# EAGLE design prject arkom robot running folower (EAGLE 9.6.2)
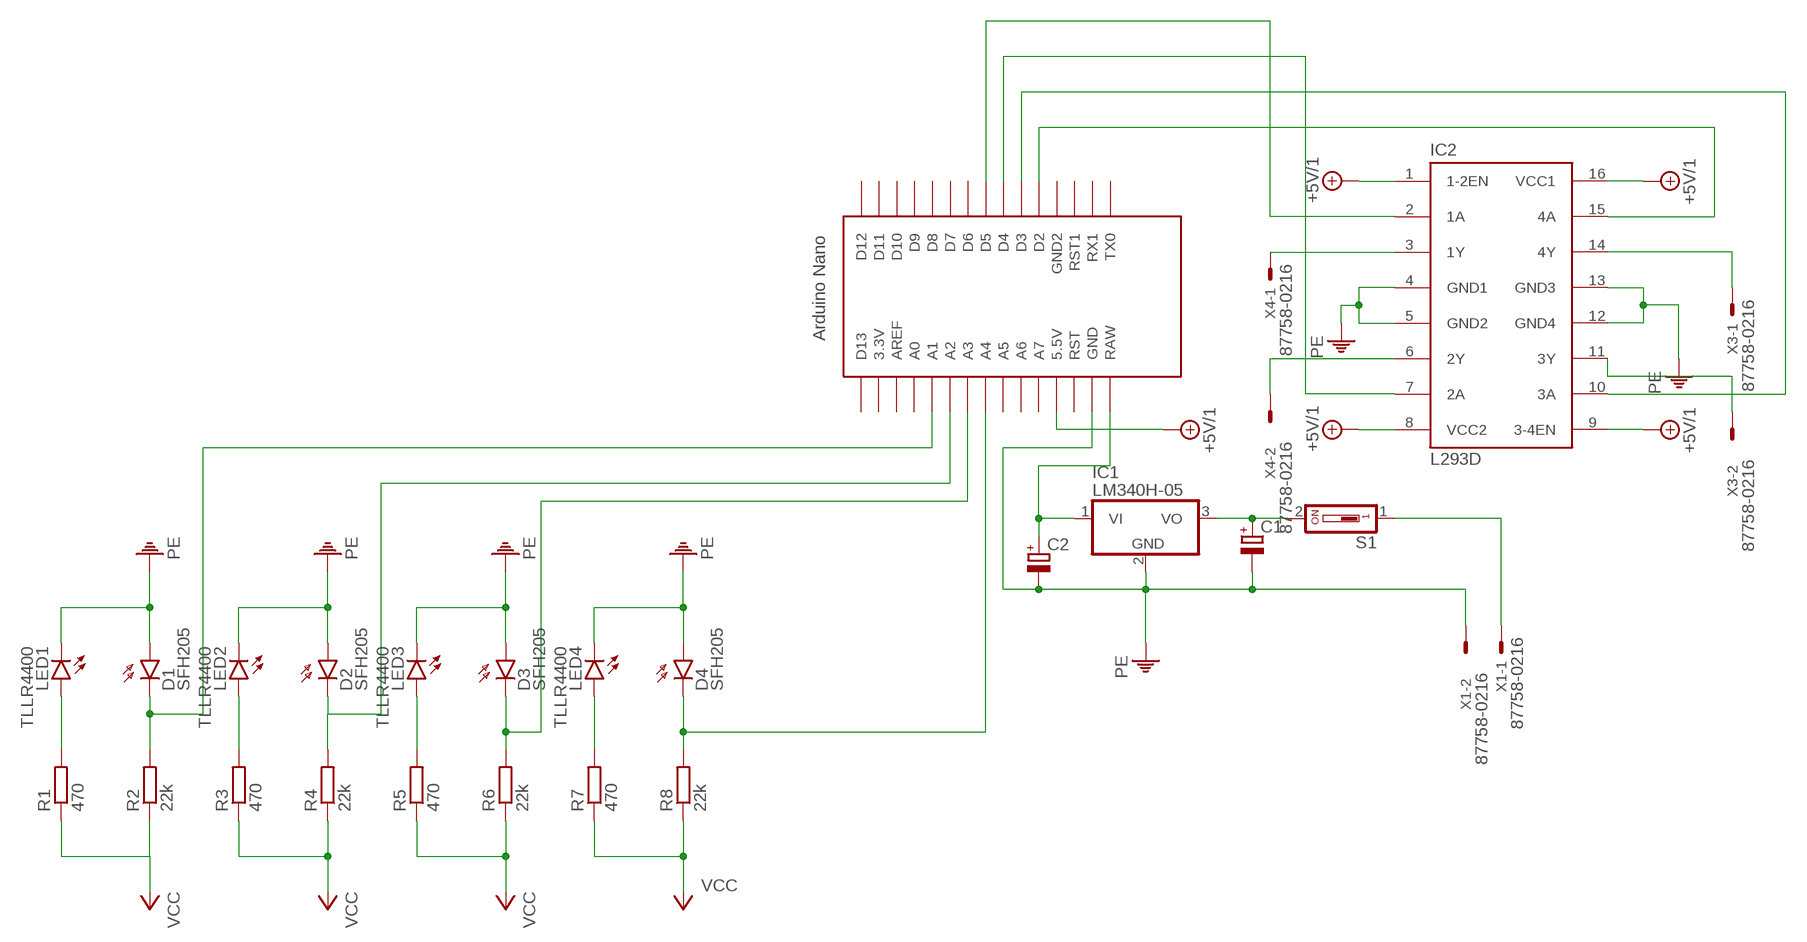
[diagram p0: schematic, sheet 1]

## Parts
C1  CPOL-EUE2.5-7  [E2,5-7]
C2  CPOL-EUE2.5-7  [E2,5-7]
D1  SFH205  [SFH205]
D2  SFH205  [SFH205]
D3  SFH205  [SFH205]
D4  SFH205  [SFH205]
IC1  LM340H-05  [TO220H]
IC2  L293D  [DIL16]
LED1  TLLR4400  [LED3MM]
LED2  TLLR4400  [LED3MM]
LED3  TLLR4400  [LED3MM]
LED4  TLLR4400  [LED3MM]
R1  470  R-EU_0204/7  [0204/7]
R2  22k  R-EU_0204/7  [0204/7]
R3  470  R-EU_0204/7  [0204/7]
R4  22k  R-EU_0204/7  [0204/7]
R5  470  R-EU_0204/7  [0204/7]
R6  22k  R-EU_0204/7  [0204/7]
R7  470  R-EU_0204/7  [0204/7]
R8  22k  R-EU_0204/7  [0204/7]
S1  SD4-01  [SD4-01]
U$1  NANO  [NANO]
X1  87758-0216  [87758-0216]
X3  87758-0216  [87758-0216]
X4  87758-0216  [87758-0216]

## Nets
+5V/1: IC2.1(1-2EN) IC2.8(VCC2) IC2.9(3-4EN) IC2.16(VCC1) U$1.5V(5.5V)
N$1: S1.1 X1.1
N$2: C1.+ IC1.3(VO) S1.2
N$3: C2.+ IC1.1(VI) U$1.RAW
N$4: IC2.3(1Y) X4.1
N$5: LED1.A R1.2
N$6: D1.K(C) R2.2 U$1.A1
N$7: LED2.A R3.2
N$8: D2.K(C) R4.2 U$1.A2
N$9: LED3.A R5.2
N$10: D3.K(C) R6.2 U$1.A3
N$11: LED4.A R7.2
N$12: D4.K(C) R8.2 U$1.A4
N$13: IC2.6(2Y) X4.2
N$14: IC2.14(4Y) X3.1
N$15: IC2.11(3Y) X3.2
N$16: IC2.15(4A) U$1.D2
N$17: IC2.10(3A) U$1.D3
N$18: IC2.7(2A) U$1.D4
N$19: IC2.2(1A) U$1.D5
PE: C1.- C2.- D1.A D2.A D3.A D4.A IC1.2(GND) IC2.4(GND1) IC2.5(GND2) IC2.12(GND4) IC2.13(GND3) LED1.K(C) LED2.K(C) LED3.K(C) LED4.K(C) U$1.GND X1.2
VCC: R1.1 R2.1 R3.1 R4.1 R5.1 R6.1 R7.1 R8.1
Unconnected: U$1.3.3V U$1.A0 U$1.A5 U$1.A6 U$1.A7 U$1.AREF U$1.D6 U$1.D7 U$1.D8 U$1.D9 U$1.D10 U$1.D11 U$1.D12 U$1.D13 U$1.GND1(GND2) U$1.ICSP1 U$1.ICSP2 U$1.ICSP3 U$1.ICSP4 U$1.ICSP5 U$1.ICSP6 U$1.RST U$1.RST1 U$1.RX1 U$1.TX0

## Library data of the parts
C1 C2 = rcl:CPOL-EU: POLARIZED CAPACITOR, European symbol; SPICEPREFIX: C
D1-D4 = opto-trans-siemens:SFH205: PHOTO DIODE; OC_FARNELL: unknown; OC_NEWARK: unknown
IC1 = linear:LM340?-*: Positive VOLTAGE REGULATOR Source: http://cache.national.com/ds/LM/LM340.pdf
IC2 = st-microelectronics:L293D: PUSH-PULL 4 CHANNEL DRIVER; MPN: L293D; OC_FARNELL: 9589619; OC_NEWARK: 56P8249
LED1-LED4 = led:TLLR4400: Low Current (2mA) LED 3 mm Tinted Diffused Package color RED Source: Data sheet <http://www.farnell.com/datasheets/391100.pdf>; MF: VISHAY SEMICONDUCTOR; OC_FARNELL: 1612437
R1-R8 = rcl:R-EU_: RESISTOR, European symbol; SPICEPREFIX: R
S1 = switch-dil:SD4-01: DIL/CODE SWITCH; OC_FARNELL: unknown; OC_NEWARK: unknown
U$1 = Arduino-clone:NANO: Arduino Nano
X1 X3 X4 = con-molex:87758-0216: 2 Pin - 2mm Dual Row Single Wafer, Vertical T/H HDR Source: http://www.molex.com/pdm_docs/sd/877580616_sd.pdf; MF: MOLEX; MPN: 87758-0216; OC_FARNELL: unknown; OC_NEWARK: 94M1513

## Board
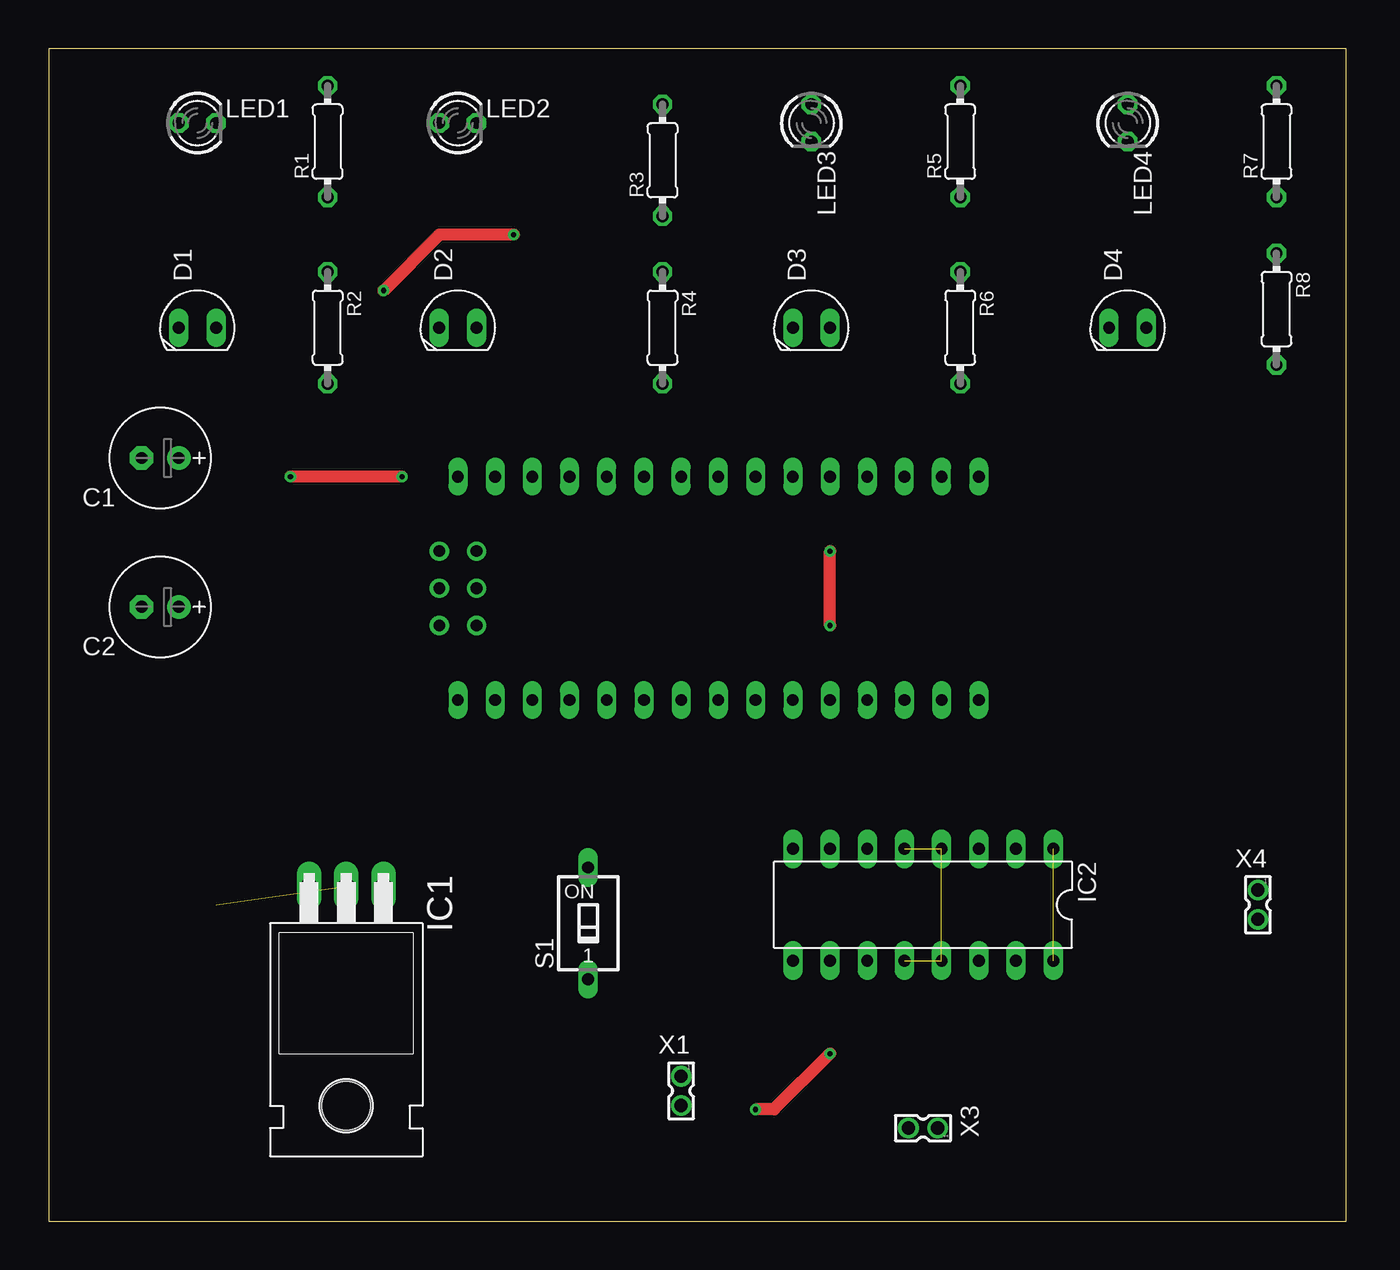
[diagram p1: board, top side]
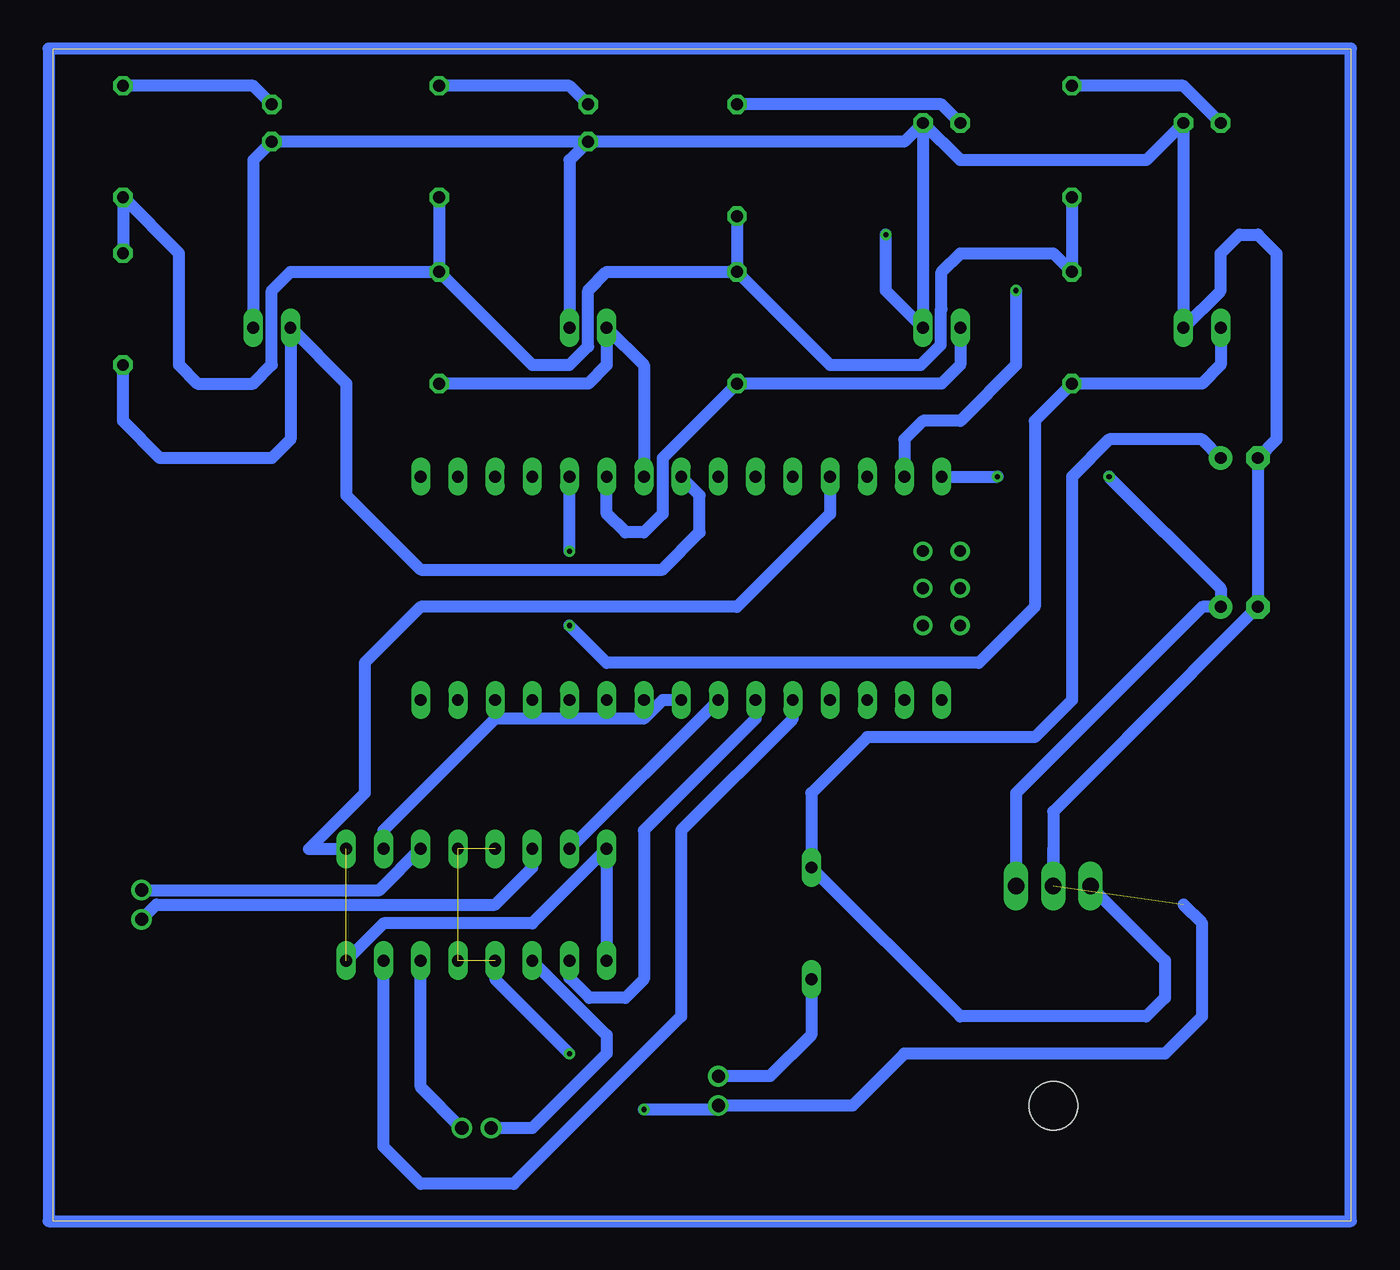
[diagram p2: board, bottom side, seen from below]

Size 88.57 x 80 mm. Coordinates in mm from the lower left corner, seen from the top.
Outline: 0,0 88.57,0 88.57,80 0,80 0,0
Copper layers (1*16): Top 0.035mm / dielectric 1.5mm / Bottom 0.035mm
Design rules "default *": minimum track width 6mil, minimum drill 0.35mm, track to track 6mil, track to pad 6mil, pad to pad 6mil, via to via 6mil, smd to smd 6mil, copper to edge 60mil, drill to drill 6mil, minimum pad ring 10mil, minimum via ring 8mil, stop-mask expansion 4mil, vias tented up to drill 0mil, thermal gap 10mil

### Footprints (pad centres in the part's own frame; a part is rotated, then mirrored left to right if it is on the bottom)
E2,5-7 = drill 0.813 pad 1.6: + -1.27,0 | drill 0.813 pad 1.6 octagon: - 1.27,0
SFH205 = drill 0.813 long: A 0,-1.27; K 0,1.27
TO220H = drill 1.118 long: 1 -2.54,-10.16; 2 0,-10.16; 3 2.54,-10.16 | hole 3.302: 0,4.826
DIL16 = drill 0.813 long: 1 -8.89,-3.81; 2 -6.35,-3.81; 3 -3.81,-3.81; 4 -1.27,-3.81; 5 1.27,-3.81; 6 3.81,-3.81; 7 6.35,-3.81; 8 8.89,-3.81; 9 8.89,3.81; 10 6.35,3.81; 11 3.81,3.81; 12 1.27,3.81; 13 -1.27,3.81; 14 -3.81,3.81; 15 -6.35,3.81; 16 -8.89,3.81
LED3MM = drill 0.813 octagon: A -1.27,0; K 1.27,0
0204/7 = drill 0.813 octagon: 1 -3.81,0; 2 3.81,0
SD4-01 = drill 0.813 long: 1 0,-3.81; 2 0,3.81
NANO = drill 0.8 long: 3.3V -10.16,24.13; 5V -10.16,-1.27; A0 -10.16,19.05; A1 -10.16,16.51; A2 -10.16,13.97; A3 -10.16,11.43; A4 -10.16,8.89; A5 -10.16,6.35; A6 -10.16,3.81; A7 -10.16,1.27; AREF -10.16,21.59; D2 5.08,1.27; D3 5.08,3.81; D4 5.08,6.35; D5 5.08,8.89; D6 5.08,11.43; D7 5.08,13.97; D8 5.08,16.51; D9 5.08,19.05; D10 5.08,21.59; D11 5.08,24.13; D12 5.08,26.67; D13 -10.16,26.67; GND -10.16,-6.35; GND1 5.08,-1.27; RAW -10.16,-8.89; RST -10.16,-3.81; RST1 5.08,-3.81; RX1 5.08,-6.35; TX0 5.08,-8.89 | drill 0.8: ICSP1 -5.08,-10.16; ICSP2 -5.08,-7.62; ICSP3 -2.54,-10.16; ICSP4 -2.54,-7.62; ICSP5 0,-10.16; ICSP6 0,-7.62
87758-0216 = drill 0.9 pad 1.27: 1 0,-1; 2 0,1

### Placement (x,y rotation side)
C1  7.62,52.07 180 top
C2  7.62,41.91 180 top
D1  10.16,60.96 90 top
D2  27.94,60.96 90 top
D3  52.07,60.96 90 top
D4  73.66,60.96 90 top
IC1  20.32,12.7 180 top
IC2  59.69,21.59 180 top
LED1  10.16,74.93 0 top
LED2  27.94,74.93 0 top
LED3  52.07,74.93 270 top
LED4  73.66,74.93 270 top
R1  19.05,73.66 90 top
R2  19.05,60.96 270 top
R3  41.91,72.39 90 top
R4  41.91,60.96 270 top
R5  62.23,73.66 90 top
R6  62.23,60.96 270 top
R7  83.82,73.66 90 top
R8  83.82,62.23 270 top
S1  36.83,20.32 0 top
U$1  36.83,40.64 270 top
X1  43.18,8.89 180 top
X3  59.69,6.35 90 top
X4  82.55,21.59 180 top

### Tracks (layer width: path | path; a pad name or v marks a point on that pad's centre or on a via)
+5V/1  (1 unrouted)
  Bottom 0.813: U$1.5V 35.56,48.26 41.91,41.91 63.5,41.91 67.31,38.1 67.31,29.21 71.12,25.4 IC2.1 | IC2.9 IC2.8 55.88,20.32 66.04,20.32 IC2.16
N$1
  Bottom 0.813: S1.1 36.83,12.7 39.64,9.89 X1.1
N$2
  Bottom 0.813: IC1.3 12.7,17.78 12.7,15.24 13.97,13.97 26.67,13.97 S1.2 36.83,29.21 33.02,33.02 21.59,33.02 19.05,35.56 19.05,50.8 16.51,53.34 10.16,53.34 C1.+
N$3  (via drill 0.35)
  Top 0.813: v24.13,50.8 v16.51,50.8
  Bottom 0.813: IC1.1 22.86,29.21 10.16,41.91 C2.+ 8.89,43.18 v16.51,50.8 | U$1.RAW v24.13,50.8
N$4
  Bottom 0.813: X4.1 66.31,22.59 IC2.3
N$5
  Bottom 0.813: LED1.A 11.43,77.47 R1.2
N$6  (via drill 0.35)
  Top 0.813: v53.34,40.64 v53.34,45.72
  Bottom 0.813: D1.K 8.89,58.42 10.16,57.15 R2.2 21.59,54.61 21.59,41.91 25.4,38.1 50.8,38.1 v53.34,40.64 | v53.34,45.72 U$1.A1
N$7
  Bottom 0.813: LED2.A 27.94,76.2 R3.2
N$8
  Bottom 0.813: D2.K 26.67,58.42 27.94,57.15 R4.2 46.99,52.07 46.99,48.26 48.26,46.99 49.53,46.99 50.8,48.26 U$1.A2
N$9
  Bottom 0.813: LED3.A 53.34,77.47 R5.2
N$10
  Bottom 0.813: R6.2 52.07,57.15 50.8,58.42 D3.K 48.26,58.42 U$1.A3
N$11
  Bottom 0.813: LED4.A 74.93,77.47 R7.2
N$12
  Bottom 0.813: R8.2 83.82,54.61 81.28,52.07 73.66,52.07 72.39,53.34 D4.K 68.58,57.15 68.58,49.53 63.5,44.45 46.99,44.45 44.45,46.99 44.45,49.53 U$1.A4
N$13
  Bottom 0.813: X4.2 81.55,21.59 58.42,21.59 55.88,24.13 IC2.6
N$14
  Bottom 0.813: X3.1 63.5,9.16 IC2.14
N$15
  Bottom 0.813: IC2.11 50.8,12.7 50.8,11.43 55.88,6.35 X3.2
N$16
  Bottom 0.813: U$1.D2 38.1,34.29 45.72,26.67 45.72,13.97 57.15,2.54 63.5,2.54 66.04,5.08 IC2.15
N$17
  Bottom 0.813: U$1.D3 40.64,34.29 48.26,26.67 48.26,16.51 49.53,15.24 51.98,15.24 53.34,16.61 IC2.10
N$18
  Bottom 0.813: IC2.7 U$1.D4
N$19
  Bottom 0.813: U$1.D5 46.99,35.56 48.26,34.29 58.42,34.29 66.04,26.67 IC2.2
N$20
  Bottom 0.813: 0,80.01 88.9,80.01 88.9,0 0,0 0,80.01
PE  (via drill 0.35)  (4 unrouted)
  Top 0.813: v31.75,67.31 26.67,67.31 v22.86,63.5 | v53.34,11.43 49.53,7.62 v48.26,7.62
  Bottom 0.813: LED2.K D2.A 31.75,63.5 v31.75,67.31 | D4.A 74.93,72.39 LED4.K LED3.K | LED3.K 53.34,72.39 D3.A | LED2.K 26.67,72.39 13.97,72.39 LED1.K D1.A 8.89,63.5 8.89,66.04 7.62,67.31 6.35,67.31 5.08,66.04 5.08,53.34 C1.- C2.- 15.24,33.02 20.32,27.94 IC1.2 20.32,25.4 | LED2.K 30.48,73.66 LED3.K | U$1.GND 30.48,53.34 29.21,54.61 26.67,54.61 22.86,58.42 v22.86,63.5 | IC2.12 58.42,16.51 v53.34,11.43 | v48.26,7.62 43.45,7.62 X1.2 34.02,7.89 30.48,11.43 12.7,11.43 10.16,13.97 10.16,19.05 10.16,20.32 11.43,21.59
VCC
  Bottom 0.813: R1.1 R2.1 20.32,66.04 26.67,66.04 27.94,64.77 27.94,62.23 27.99,62.18 27.99,59.8 29.36,58.42 35.56,58.42 R4.1 | R3.1 R4.1 | R5.1 R6.1 | R8.1 R7.1 80.01,66.04 80.01,58.42 78.74,57.15 74.93,57.15 73.66,58.42 73.66,63.5 72.39,64.77 R6.1 | R4.1 50.8,64.77 52.07,63.5 52.07,59.69 53.34,58.42 55.88,58.42 R6.1